# Altium schematic sheet half_bridge.SchDoc
size A
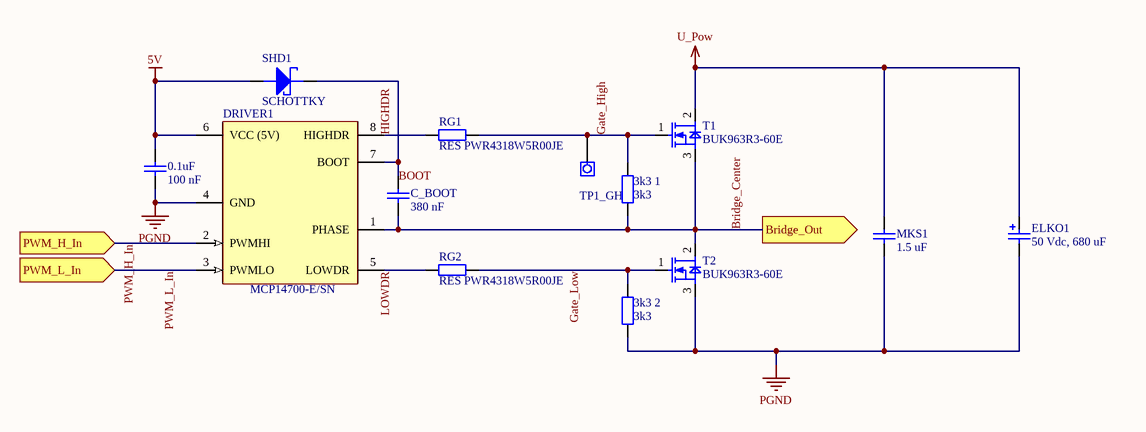
[diagram p0: half_bridge.SchDoc]

## Parts
0.1uF  100 nF  [0805_C]
3k3_1  3k3  [0805_R]
3k3_2  3k3  [0805_R]
C_BOOT  380 nF  [0805_C]
DRIVER1  MCP14700-E/SN  [SO-8]
ELKO1  50 Vdc, 680 uF  [WCAP-ATG8_13x20x5]
MKS1  1.5 uF  [WIMA MKS4]
RG1  RES PWR4318W5R00JE  [Gate resistor]
RG2  RES PWR4318W5R00JE  [Gate resistor]
SHD1  SCHOTTKY  [FP_SMB]
T1  BUK963R3-60E  [D2PAK - HEAT SINK]
T2  BUK963R3-60E  [D2PAK - HEAT SINK]
TP1_GH  Testpoint  [TESTPOINT_1.5]  (value not drawn)  (no BOM)

## Ports
Bridge_Out (out), PWM_H_In (in), PWM_L_In (in)

## Nets
5V: 0.1uF.2 DRIVER1.6(VCC_(5V)) SHD1.2(ANODE)
PGND: 0.1uF.1 3k3_2.1 DRIVER1.4(GND) ELKO1.2(N) MKS1.2 T2.3(S)
U_Pow: ELKO1.1(P) MKS1.1 T1.2(D)
BOOT: C_BOOT.1 DRIVER1.7(BOOT) SHD1.1(CATHODE)
Bridge_Center: 3k3_1.1 C_BOOT.2 DRIVER1.1(PHASE) T1.3(S) T2.2(D) ; port Bridge_Out
Gate_High: 3k3_1.2 RG1.2 T1.1(G) TP1_GH.1
Gate_Low: 3k3_2.2 RG2.2 T2.1(G)
HIGHDR: DRIVER1.8(HIGHDR) RG1.1
LOWDR: DRIVER1.5(LOWDR) RG2.1
PWM_H_In: DRIVER1.2(PWMHI) ; port PWM_H_In
PWM_L_In: DRIVER1.3(PWMLO) ; port PWM_L_In

## Library data of the parts
0.1uF C_BOOT = CAP 0805
3k3_1 3k3_2 = RES 0805
DRIVER1 = MCP14700-E/SN: MCP14700 Series 2 A 5.5 V SMT High / Low Side Dual Input MOSFET Driver - SOIC-8; MF: Microchip; Digi-Key_Purchase_URL: https://www.digikey.hu/product-detail/en/microchip-technology/MCP14700-E-SN/MCP14700-E-SN-ND/2171231?WT.z_cid=ref_snapeda&utm_source=snapeda&utm_medium=aggregator&utm_campaign=buynow; SnapEDA_Link: https://www.snapeda.com/parts/MCP14700-E/SN/Microchip/view-part/?ref=snap; MP: MCP14700-E/SN; Digi-Key_Part_Number: MCP14700-E/SN-ND; Package: SOIC-8 Microchip; Value: *; ComponentLink1Description: Farnell; ComponentLink1URL: https://hu.farnell.com/microchip/mcp14700-e-sn/ic-mosfet-driver-high-low-8soic/dp/1825000?krypto=%2Fae0lHKq7iwe9QI%2BjtZ19gpo8mtYyj1vkEEZDvYxTXzaFiTkqoZ1lGkXLUrglalKNguY5aTWMykQhjRRj5KExv5TFNC3t1gkL2Uuk%2BV8FU8Z%2BFLx3XX2gQd9pUPTvy2FvkJO5L1m3mhW9%2FhmAxbSXILSB4AR3lg%2Bczo0eyyo2jH2vbeCpfa1DWXOQaI1mYv4&ddkey=https%3Ahu-HU%2FElement14_Hungary%2Fw%2Fsearch
ELKO1 = ELKO 860010678022: WCAP-ATG8 Aluminum Electrolytic Capacitors, 13x20mm, 50 Vdc, 680 uF; Rated Voltage: 50 Vdc; Value: 680 uF; ComponentLink1Description: Manufacturer; ComponentLink1URL: http://www.we-online.de; ComponentLink2Description: Datasheet; ComponentLink2URL: http://katalog.we-online.de/pbs/datasheet/860010678022.pdf; Part Number: 860010678022; Published Date: Sep. 2017; Publisher: Wurth Elektronik; Size: 13x20mm; Life Cycle: 2000h; Operating Temperature: -40 °C up to +85 °C; ComponentLink3Description: FArnell.com; ComponentLink3URL: https://hu.farnell.com/wurth-elektronik/860010678022/cap-680-f-50v-20/dp/2465746
MKS1 = CAP MKS4: MKS4D041504D00KSSD - AC Film Capacitor, 1.5 µF, 100 V, PET (Polyester), ± 10%, MKS4 Series; Part Class: Capacitor; ComponentLink1Description: Farnell.com; ComponentLink1URL: https://hu.farnell.com/wima/mks4d041504d00kssd/cap-film-pet-1-5uf-100v-rad/dp/156887?ost=MKS4D041504D00KSSD&scope=partnumberlookahead&exaMfpn=true&searchref=searchlookahead&ddkey=http%3Ahu-HU%2FElement14_Hungary%2Fw%2Fsearch
RG1 RG2 = RES PWR4318W5R00JE: PWR4318W5R00JE -  SMD Chip Resistor, 5 ohm, PWR Series, Wirewound, SMD, 2 W; ComponentLink1Description: Farnell.com; ComponentLink1URL: https://hu.farnell.com/bourns/pwr4318w5r00je/res-5r-5-2w-wirewound/dp/2328356?st=PWR4318W5R00JE
SHD1 = SCHOTTKY: SS26T3G -  Schottky Rectifier, 60 V, 2 A, Single, DO-214AA, 2 Pins, 630 mV; ComponentLink1Description: Farnell.com; ComponentLink1URL: https://hu.farnell.com/on-semiconductor/ss26t3g/diode-schottky-2a-60v-do-214aa/dp/2317411
T1 T2 = BUK963R3-60E: MOSFET N Channel, 120 A, 60 V, 0.00273 ohm; K_Manufacturer: NXP; Order Code: 2112537; CompType: PSMN016-100BS; Distributor: Farnell; Package: TO-263 (D^2 PAK); ComponentLink1Description: Farnell; ComponentLink1URL: https://hu.farnell.com/nexperia/buk963r3-60e/mosfet-n-ch-60v-120a-d2pak/dp/2254201?krypto=I803Bq3qCpO4VbPAVkxyizpLyi%2FdiGqKwdt0r9PEh6X27v%2BtYRmR7Ze3dlOwjgHxuQItFyOlfA1mnHJ%2B8pbpPTMqmfB6qckuiMJ6rY33veItyhwnbOKdw3akfsBlxViD4E5vEDNnNT9rPvSW6d%2BsIc9XHFtmthjGnDHHsoW3BRw2sLBOQZX96l8HKlFiTr6e&ddkey=https%3Ahu-HU%2FElement14_Hungary%2Fw%2Fsearch; ComponentLink2Description: Farnell Heat Sink; ComponentLink2URL: https://hu.farnell.com/ohmite/dv-t263-101e/heatsink-smd-d2-pack-no-finish/dp/2097700
TP1_GH = Testpoint: Part Class: Connector